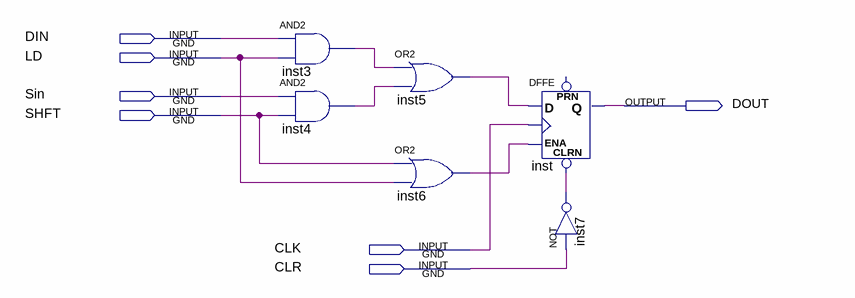
[diagram p0: schematic sheet]
// Quartus schematic reg1_ld_clr_sh.bdf as structural Verilog: 6 symbols, 7 pins
module reg1_ld_clr_sh (
  input  DIN,
  input  LD,
  input  Sin,
  input  SHFT,
  input  CLK,
  input  CLR,
  output DOUT
);

  wire inst3_out, inst4_out, inst5_out, inst6_out, inst7_out;

  and inst3 (inst3_out, DIN, LD);
  and inst4 (inst4_out, Sin, SHFT);
  or inst5 (inst5_out, inst3_out, inst4_out);
  or inst6 (inst6_out, SHFT, LD);
  DFFE inst (.CLRN(inst7_out), .D(inst5_out), .CLK(CLK), .ENA(inst6_out), .Q(DOUT));  // open: PRN
  not inst7 (inst7_out, CLR);
endmodule
